# Altium schematic sheet XC7A35TFTG256.SchDoc
size A4; DocumentNumber: 13; SheetNumber: 13; SheetTotal: 21; SheetName: FPGA Top level
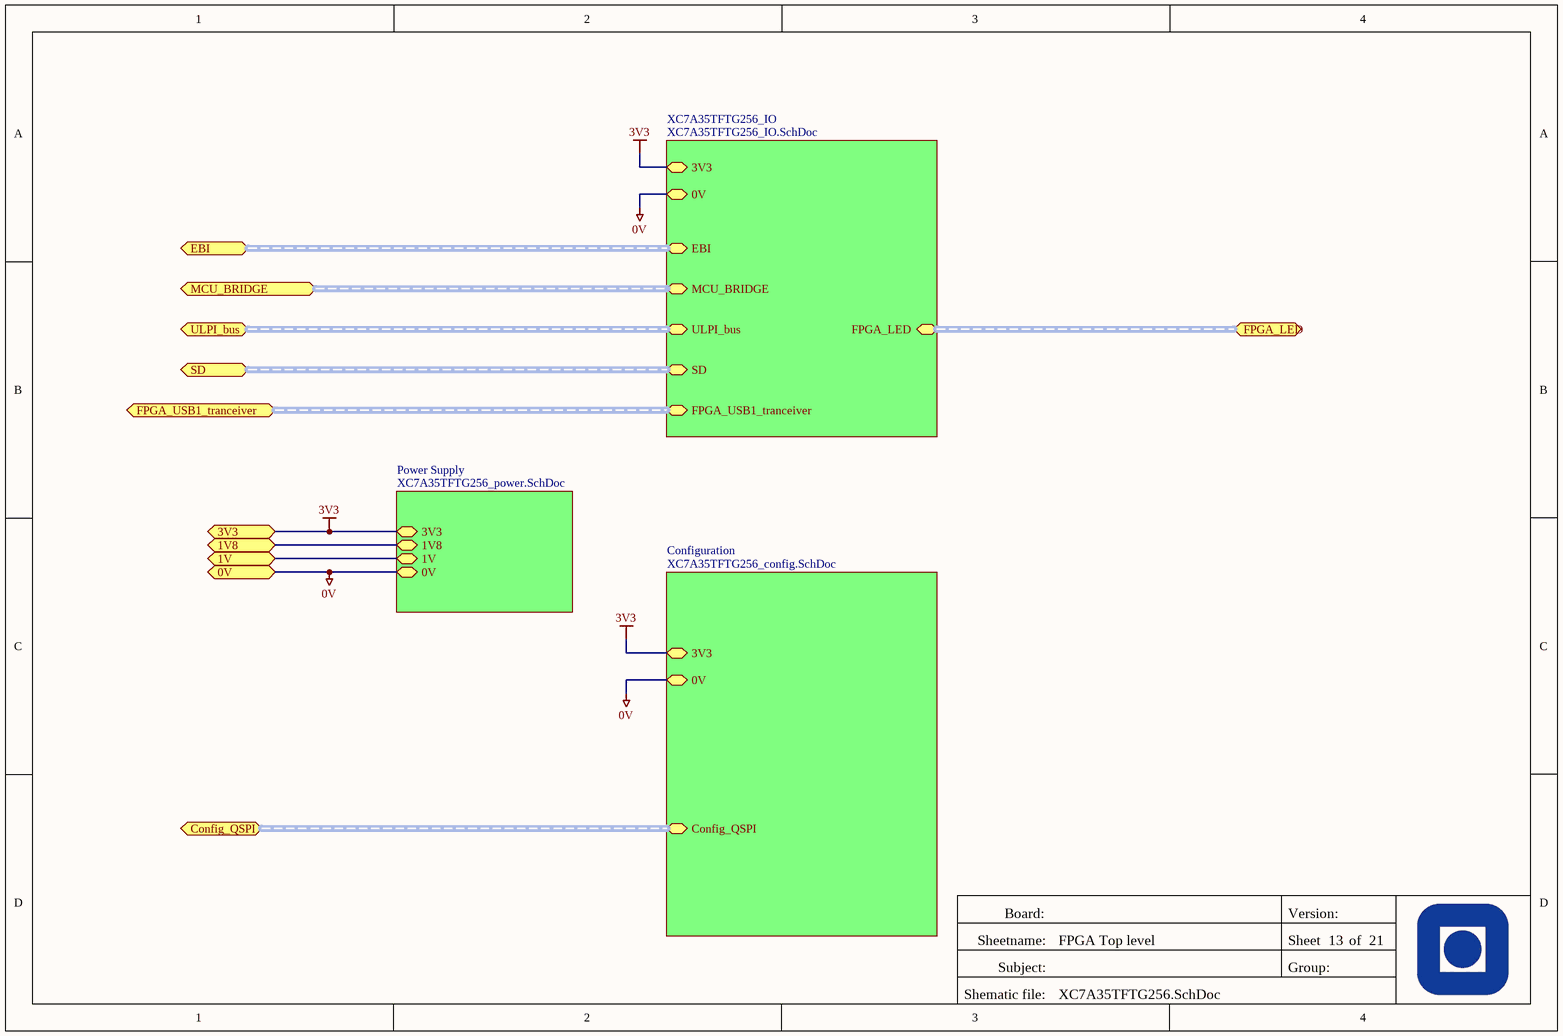
[diagram p0: XC7A35TFTG256.SchDoc]

## Sub-sheets
Configuration = XC7A35TFTG256_config.SchDoc: 3V3, 0V, Config_QSPI (harness QSPI)
Power Supply = XC7A35TFTG256_power.SchDoc: 3V3, 1V8, 1V, 0V
XC7A35TFTG256_IO = XC7A35TFTG256_IO.SchDoc: EBI (harness EBI), MCU_BRIDGE (harness MCU_CTRL_LOGIC), ULPI_bus (harness ULPI), FPGA_LED (harness LED_Harness), SD (harness Sd_card), 3V3, 0V, FPGA_USB1_tranceiver (harness USB1_FS_harness)

## Ports
0V, 1V, 1V8, 3V3, Config_QSPI (harness QSPI), EBI (harness EBI), FPGA_LED (harness LED_Harness), FPGA_USB1_tranceiver (harness USB1_FS_harness), MCU_BRIDGE (harness MCU_CTRL_LOGIC), SD (harness SD_card), ULPI_bus (harness ULPI)

## Nets
0V: port 0V, sheet Power Supply/0V, sheet Configuration/0V, sheet XC7A35TFTG256_IO/0V
3V3: port 3V3, sheet Power Supply/3V3, sheet Configuration/3V3, sheet XC7A35TFTG256_IO/3V3
1V: port 1V, sheet Power Supply/1V
1V8: port 1V8, sheet Power Supply/1V8

## Buses and harness runs
harness port Config_QSPI = sheet Configuration/Config_QSPI
harness port EBI = sheet XC7A35TFTG256_IO/EBI
harness port FPGA_LED = sheet XC7A35TFTG256_IO/FPGA_LED
harness port FPGA_USB1_tranceiver = sheet XC7A35TFTG256_IO/FPGA_USB1_tranceiver
harness port MCU_BRIDGE = sheet XC7A35TFTG256_IO/MCU_BRIDGE
harness port SD = sheet XC7A35TFTG256_IO/SD
harness port ULPI_bus = sheet XC7A35TFTG256_IO/ULPI_bus

## Notes on the sheet
- Board:
- Version:
- Sheetname:
- Subject:
- Group:
- Sheet
- of
- Shematic file: